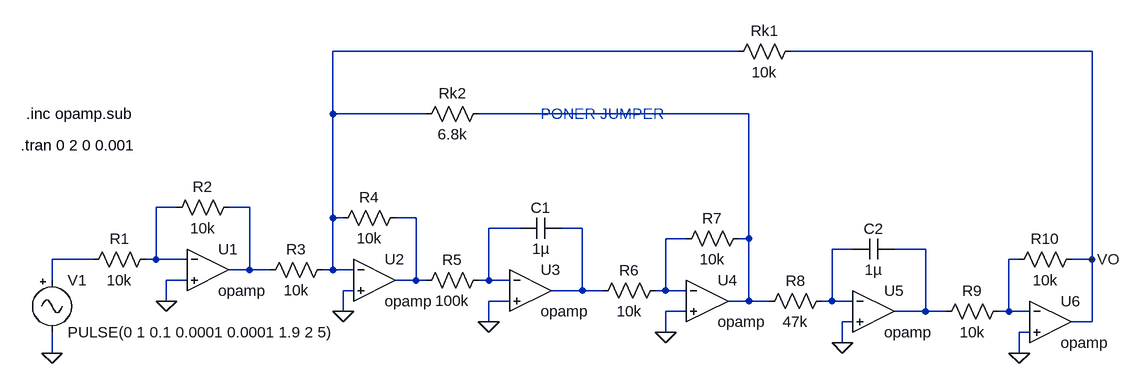
[diagram p0: schematic SistemaOpamp.asc]
SistemaOpamp.asc, the LTspice schematic file:
Version 4
SHEET 1 1268 680
WIRE 688 -160 64 -160
WIRE 1232 -160 768 -160
WIRE 64 -64 64 -160
WIRE 208 -64 64 -64
WIRE 704 -64 288 -64
WIRE -176 80 -208 80
WIRE -64 80 -96 80
WIRE 64 96 64 -64
WIRE 80 96 64 96
WIRE 192 96 160 96
WIRE 352 112 304 112
WIRE 448 112 416 112
WIRE 608 128 576 128
WIRE 704 128 704 -64
WIRE 704 128 688 128
WIRE 864 144 832 144
WIRE 976 144 928 144
WIRE -304 160 -368 160
WIRE -208 160 -208 80
WIRE -208 160 -224 160
WIRE -160 160 -208 160
WIRE 1120 160 1104 160
WIRE 1232 160 1232 -160
WIRE 1232 160 1200 160
WIRE -64 176 -64 80
WIRE -64 176 -96 176
WIRE -32 176 -64 176
WIRE 64 176 64 96
WIRE 64 176 48 176
WIRE 96 176 64 176
WIRE -368 192 -368 160
WIRE -160 192 -192 192
WIRE 192 192 192 96
WIRE 192 192 160 192
WIRE 208 192 192 192
WIRE 304 192 304 112
WIRE 304 192 288 192
WIRE 336 192 304 192
WIRE 96 208 80 208
WIRE 448 208 448 112
WIRE 448 208 400 208
WIRE 480 208 448 208
WIRE 576 208 576 128
WIRE 576 208 560 208
WIRE 608 208 576 208
WIRE -192 224 -192 192
WIRE 336 224 304 224
WIRE 704 224 704 128
WIRE 704 224 672 224
WIRE 736 224 704 224
WIRE 832 224 832 144
WIRE 832 224 816 224
WIRE 864 224 832 224
WIRE 80 240 80 208
WIRE 608 240 576 240
WIRE 976 240 976 144
WIRE 976 240 928 240
WIRE 1008 240 976 240
WIRE 1104 240 1104 160
WIRE 1104 240 1088 240
WIRE 1136 240 1104 240
WIRE 304 256 304 224
WIRE 864 256 848 256
WIRE 1232 256 1232 160
WIRE 1232 256 1200 256
WIRE 576 272 576 240
WIRE 1136 272 1120 272
WIRE 848 288 848 256
WIRE -368 304 -368 272
WIRE 1120 304 1120 272
FLAG -192 224 0
FLAG 80 240 0
FLAG 304 256 0
FLAG 576 272 0
FLAG 848 288 0
FLAG 1120 304 0
FLAG 1232 160 VO
FLAG -368 304 0
SYMBOL Opamps\\opamp -128 112 R0
SYMATTR InstName U1
SYMBOL Opamps\\opamp 128 128 R0
SYMATTR InstName U2
SYMBOL Opamps\\opamp 368 144 R0
SYMATTR InstName U3
SYMBOL Opamps\\opamp 640 160 R0
SYMATTR InstName U4
SYMBOL Opamps\\opamp 896 176 R0
SYMATTR InstName U5
SYMBOL Opamps\\opamp 1168 192 R0
SYMATTR InstName U6
SYMBOL res -80 64 R90
WINDOW 0 0 56 VBottom 2
WINDOW 3 32 56 VTop 2
SYMATTR InstName R2
SYMATTR Value 10k
SYMBOL res -208 144 R90
WINDOW 0 0 56 VBottom 2
WINDOW 3 32 56 VTop 2
SYMATTR InstName R1
SYMATTR Value 10k
SYMBOL res 64 160 R90
WINDOW 0 0 56 VBottom 2
WINDOW 3 32 56 VTop 2
SYMATTR InstName R3
SYMATTR Value 10k
SYMBOL res 176 80 R90
WINDOW 0 0 56 VBottom 2
WINDOW 3 32 56 VTop 2
SYMATTR InstName R4
SYMATTR Value 10k
SYMBOL res 304 176 R90
WINDOW 0 0 56 VBottom 2
WINDOW 3 32 56 VTop 2
SYMATTR InstName R5
SYMATTR Value 100k
SYMBOL cap 416 96 R90
WINDOW 0 0 32 VBottom 2
WINDOW 3 32 32 VTop 2
SYMATTR InstName C1
SYMATTR Value 1µ
SYMBOL res 576 192 R90
WINDOW 0 0 56 VBottom 2
WINDOW 3 32 56 VTop 2
SYMATTR InstName R6
SYMATTR Value 10k
SYMBOL res 704 112 R90
WINDOW 0 0 56 VBottom 2
WINDOW 3 32 56 VTop 2
SYMATTR InstName R7
SYMATTR Value 10k
SYMBOL res 832 208 R90
WINDOW 0 0 56 VBottom 2
WINDOW 3 32 56 VTop 2
SYMATTR InstName R8
SYMATTR Value 47k
SYMBOL cap 928 128 R90
WINDOW 0 0 32 VBottom 2
WINDOW 3 32 32 VTop 2
SYMATTR InstName C2
SYMATTR Value 1µ
SYMBOL res 1104 224 R90
WINDOW 0 0 56 VBottom 2
WINDOW 3 32 56 VTop 2
SYMATTR InstName R9
SYMATTR Value 10k
SYMBOL res 1216 144 R90
WINDOW 0 0 56 VBottom 2
WINDOW 3 32 56 VTop 2
SYMATTR InstName R10
SYMATTR Value 10k
SYMBOL Misc\\signal -368 176 R0
WINDOW 123 0 0 Left 2
WINDOW 39 0 0 Left 2
SYMATTR InstName V1
SYMATTR Value PULSE(0 1 0.1 0.0001 0.0001 1.9 2 5)
SYMBOL res 304 -80 R90
WINDOW 0 0 56 VBottom 2
WINDOW 3 32 56 VTop 2
SYMATTR InstName Rk2
SYMATTR Value 6.8k
SYMBOL res 784 -176 R90
WINDOW 0 0 56 VBottom 2
WINDOW 3 32 56 VTop 2
SYMATTR InstName Rk1
SYMATTR Value 10k
TEXT -416 -16 Left 2 !.tran 0 2 0 0.001
TEXT -408 -64 Left 2 !.inc opamp.sub
TEXT 384 -64 Left 2 ;PONER JUMPER

The netlist it stands for:
* SistemaOpamp.asc
XU1 N003 0 N004 opamp Aol=100K GBW=10Meg  ; pins invin noninvin out
XU2 N001 0 N005 opamp Aol=100K GBW=10Meg  ; pins invin noninvin out
XU3 N006 0 N007 opamp Aol=100K GBW=10Meg  ; pins invin noninvin out
XU4 N008 0 N002 opamp Aol=100K GBW=10Meg  ; pins invin noninvin out
XU5 N009 0 N010 opamp Aol=100K GBW=10Meg  ; pins invin noninvin out
XU6 N012 0 VO opamp Aol=100K GBW=10Meg  ; pins invin noninvin out
R2 N004 N003 10k
R1 N003 N011 10k
R3 N001 N004 10k
R4 N005 N001 10k
R5 N006 N005 100k
C1 N007 N006 1µ
R6 N008 N007 10k
R7 N002 N008 10k
R8 N009 N002 47k
C2 N010 N009 1µ
R9 N012 N010 10k
R10 VO N012 10k
V1 N011 0 PULSE(0 1 0.1 0.0001 0.0001 1.9 2 5)
Rk2 N002 N001 6.8k
Rk1 VO N001 10k
.tran 0 2 0 0.001
.inc opamp.sub
* PONER JUMPER
.backanno
.end